# Altium schematic sheet OK6010_DB_DAC_f.SchDoc
size 260 x 195 mm; PageSetup: Record=PageOptions|CenterHorizontal=True|CenterVertical=True|PrintScale=1.02|XCorrection=1.00|YCorrection=1.00|PrintKind=2|BorderSize=5000000|LeftOffset=0|BottomOffset=0|Orientation=2|PaperLength=1000|PaperWidth=1000|Scale=100|PaperSource=15|PrintQuality=600|MediaType=1|DitherType=10|PaperKind=Letter|PrintScaleMode=1
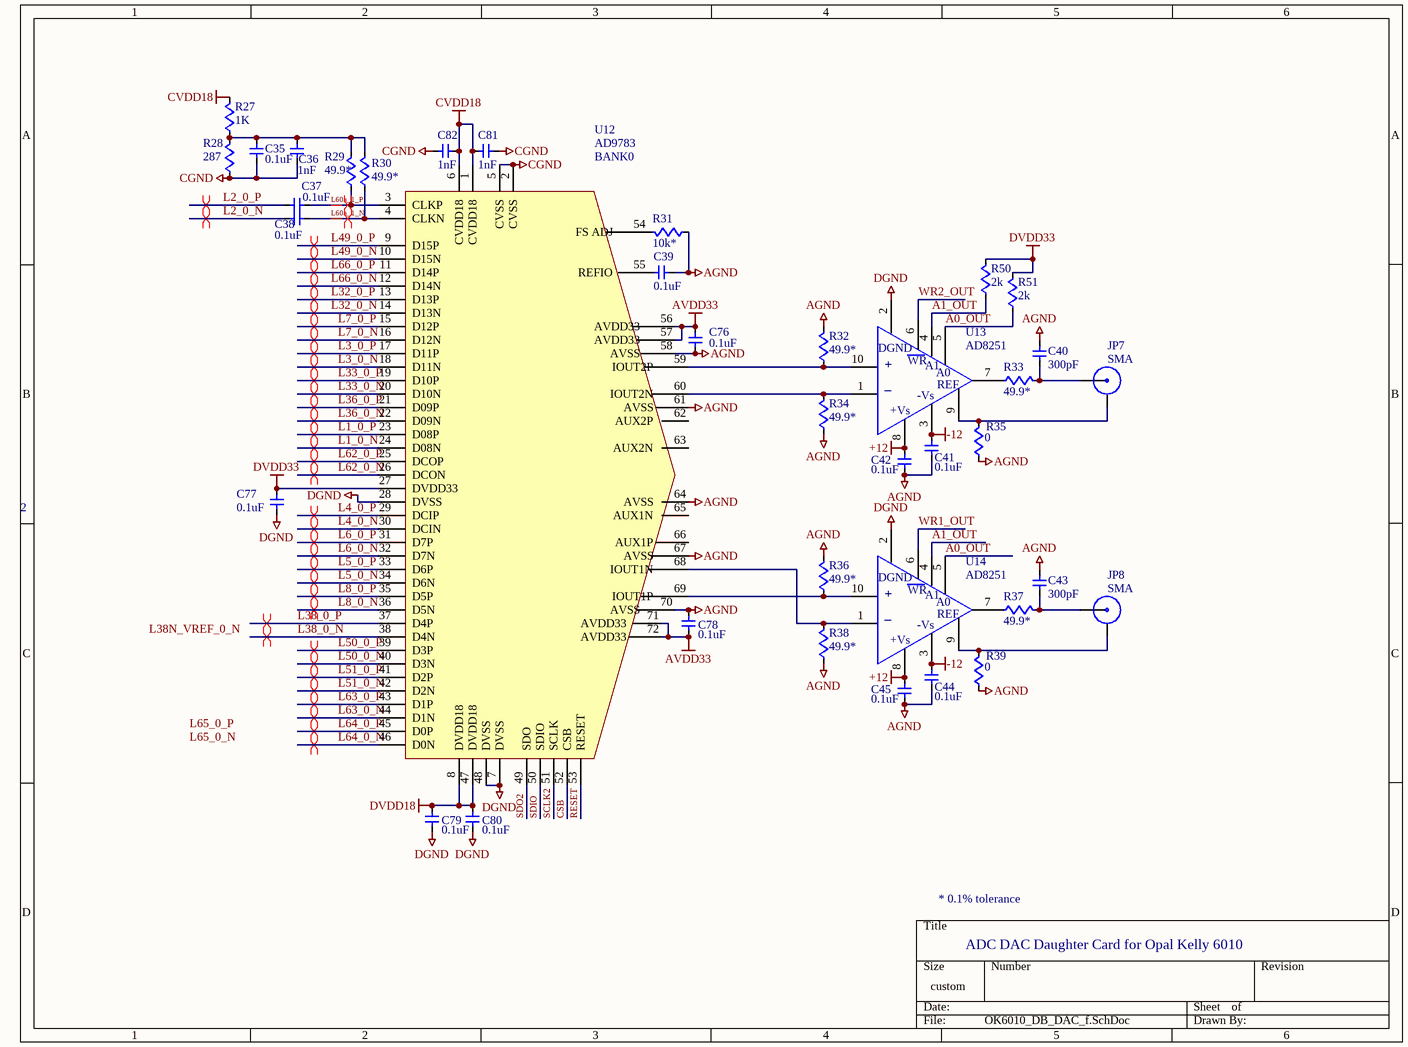
[diagram p0: OK6010_DB_DAC_f.SchDoc]

## Parts
C35  0.1uF  [0603w]
C36  1nF  [0603w]
C37  0.1uF  [1206]
C38  0.1uF  [1206]
C39  0.1uF  [0603w]
C40  300pF  [0603w]
C41  0.1uF  [0603w]
C42  0.1uF  [0603w]
C43  300pF  [0603w]
C44  0.1uF  [0603w]
C45  0.1uF  [0603w]
C76  0.1uF  [0603w]
C77  0.1uF  [0603w]
C78  0.1uF  [0603w]
C79  0.1uF  [0603w]
C80  0.1uF  [0603w]
C81  1nF  [0603w]
C82  1nF  [0603w]
JP7  SMA  [sma_pcb_200]
JP8  SMA  [sma_pcb_200]
R27  1K  [0603w]
R28  287  [0603w]
R29  49.9*  [0603w]
R30  49.9*  [0603w]
R31  10k*  [0603w]
R32  49.9*  [0603w]
R33  49.9*  [0603w]
R34  49.9*  [0603w]
R35  0  [0603w]
R36  49.9*  [0603w]
R37  49.9*  [0603w]
R38  49.9*  [0603w]
R39  0  [0603w]
R50  2k  [0603w]
R51  2k  [0603w]
U12  AD9783  [LFCSP72]
U13  AD8251  [MSOP10sm]
U14  AD8251  [MSOP10sm]

## Nets
+12: C42.2 C45.2 U13.8 U14.8
-12: C41.2 C44.2 U13.3 U14.3
AGND: C39.2 C40.2 C41.1 C42.1 C43.2 C44.1 C45.1 C76.1 C78.2 R31.1 R32.2 R34.1 R35.1 R36.2 R38.1 R39.1 U12.58(AVSS) U12.61(AVSS) U12.64(AVSS) U12.67(AVSS) U12.70(AVSS)
AVDD33: C76.2 C78.1 U12.56(AVDD33) U12.57(AVDD33) U12.71(AVDD33) U12.72(AVDD33)
CGND: C35.2 C36.2 C81.2 C82.2 R28.1 U12.2(CVSS) U12.5(CVSS)
CVDD18: C81.1 C82.1 R27.2 U12.1(CVDD18) U12.6(CVDD18)
DGND: C77.2 C79.1 C80.1 U12.7(DVSS) U12.28(DVSS) U12.48(DVSS) U13.2 U14.2
DVDD18: C79.2 C80.2 U12.8(DVDD18) U12.47(DVDD18)
DVDD33: C77.1 R50.2 R51.2 U12.27(DVDD33)
A0_OUT: R51.1 U13.5 U14.5
A1_OUT: R50.1 U13.4 U14.4
CSB: U12.52(CSB)
L1_0_N: U12.24(D08N)
L1_0_P: U12.23(D08P)
L2_0_N: C38.1
L2_0_P: C37.1
L3_0_N: U12.18(D11N)
L3_0_P: U12.17(D11P)
L4_0_N: U12.30(DCIN)
L4_0_P: U12.29(DCIP)
L5_0_N: U12.34(D6N)
L5_0_P: U12.33(D6P)
L6_0_N: U12.32(D7N)
L6_0_P: U12.31(D7P)
L7_0_N: U12.16(D12N)
L7_0_P: U12.15(D12P)
L8_0_N: U12.36(D5N)
L8_0_P: U12.35(D5P)
L32_0_N: U12.14(D13N)
L32_0_P: U12.13(D13P)
L33_0_N: U12.20(D10N)
L33_0_P: U12.19(D10P)
L36_0_N: U12.22(D09N)
L36_0_P: U12.21(D09P)
L38_0_N: U12.38(D4N)
L38_0_P: U12.37(D4P)
L49_0_N: U12.10(D15N)
L49_0_P: U12.9(D15P)
L50_0_N: U12.40(D3N)
L50_0_P: U12.39(D3P)
L51_0_N: U12.42(D2N)
L51_0_P: U12.41(D2P)
L60a_1_N: C38.2 R30.1 U12.4(CLKN)
L60a_1_P: C37.2 R29.1 U12.3(CLKP)
L62_0_N: U12.26(DCON)
L62_0_P: U12.25(DCOP)
L63_0_N: U12.44(D1N)
L63_0_P: U12.43(D1P)
L64_0_N: U12.46(D0N)
L64_0_P: U12.45(D0P)
L66_0_N: U12.12(D14N)
L66_0_P: U12.11(D14P)
RESET: U12.53(RESET)
SCLK2: U12.51(SCLK)
SDIO: U12.50(SDIO)
SDO2: U12.49(SDO)
WR1_OUT: U14.6
WR2_OUT: U13.6
NetC35_1: C35.1 C36.1 R27.1 R28.2 R29.2 R30.2
NetC39_1: C39.1 U12.55(REFIO)
NetC40_1: C40.1 JP7.1(signal) R33.2
NetC43_1: C43.1 JP8.1(signal) R37.2
NetJP7_0: JP7.0(ground) R35.2 U13.9
NetJP8_0: JP8.0(ground) R39.2 U14.9
NetR31_2: R31.2 U12.54(FS_ADJ)
NetR32_1: R32.1 U12.59(IOUT2P) U13.10
NetR33_1: R33.1 U13.7
NetR34_2: R34.2 U12.60(IOUT2N) U13.1
NetR36_1: R36.1 U12.69(IOUT1P) U14.10
NetR37_1: R37.1 U14.7
NetR38_2: R38.2 U12.68(IOUT1N) U14.1

Not connected (* = marked no-connect by the designer): U12 62(AUX2P) 63(AUX2N) 65(AUX1N) 66(AUX1P)

## Layout directives
differential pair: L1_0_N, L1_0_P, L2_0_N, L2_0_P, L3_0_N, L3_0_P, L4_0_N, L4_0_P, L5_0_N, L5_0_P, L6_0_N, L6_0_P, L7_0_N, L7_0_P, L8_0_N, L8_0_P, L32_0_N, L32_0_P, L33_0_N, L33_0_P, L36_0_N, L36_0_P, L38_0_N, L38_0_P, L49_0_N, L49_0_P, L50_0_N, L50_0_P, L51_0_N, L51_0_P, L60a_1_N, L60a_1_P, L62_0_N, L62_0_P, L63_0_N, L63_0_P, L64_0_N, L64_0_P, L66_0_N, L66_0_P

## Notes on the sheet
- (near U12) BANK0
- 2
- * 0.1% tolerance
- ADC DAC Daughter Card for Opal Kelly 6010
- Labels drawn without touching a wire or pin: L38N_VREF_0_N, L65_0_N, L65_0_P
- (in symbol AD8251) DGND; WR; +; A1; A0; _; REF; -Vs; +Vs

## Library data of the parts
C35 C39 C41 C42 C44 C45 C76-C80 = CAP_SM_1: capacitor; Manufacturer: Kemet; Manufacturer Part Number: C0603C104K3RACTU; Capacitance: 0.1µF; Temperature Coefficient: X7R; Tolerance: ±10%; Voltage - Rated: 25V; Applications: General Purpose; Category: Capacitors; ComponentLink1Description: http://www.kemet.com/datasheets&C0603C104K3RACTU; ComponentLink1URL: http://www.kemet.com/datasheets&C0603C104K3RACTU; Features: -; Lead Spacing: -; Lead Style: -; Mounting Type: Surface Mount, MLCC; Operating Temperature: -55°C ~ 125°C; Package / Case: 0603 (1608 Metric); Packaging: Cut Tape (CT); Pricing 1: 10=0.075, 100=0.027, 250=0.01952, 500=0.0144, 1000=0.00975 (USD); Ratings: -; RoHS: RoHS Compliant; Size / Dimension: 0.063" L x 0.032" W (1.60mm x 0.80mm); Stock 1: 2338960; Supplier 1: Digi-Key; Supplier Part Number 1: 399-1281-1-ND; Thickness: 0.80mm
C36 C81 C82 = CAP_SM_1: capacitor; Manufacturer: Murata Electronics North America; Manufacturer Part Number: GRM188R71H102KA01D; Description: CAP CER 1000PF 50V 10% X7R 0603; Capacitance: 1000pF; Voltage - Rated: 50V; Tolerance: ±10%; Temperature Coefficient: X7R; Supplier 1: Digi-Key; Supplier Part Number 1: 490-1494-1-ND; RoHS: RoHS Compliant; Category: Capacitors; Stock 1: 512721; Pricing 1: 1=0.07, 10=0.043, 50=0.0204, 100=0.0153, 250=0.01104, 500=0.00816, 1000=0.00553 (USD); Mounting Type: Surface Mount, MLCC; Operating Temperature: -55°C ~ 125°C; Applications: General Purpose; Ratings: -; Package / Case: 0603 (1608 Metric); Size / Dimension: 0.063" L x 0.031" W (1.60mm x 0.80mm); Height: -; Thickness: 0.035" (0.90mm); Lead Spacing: -; Features: -; Packaging: Cut Tape (CT); Lead Style: -; ComponentLink1URL: http://search.murata.co.jp/Ceramy/image/img/PDF/ENG/GRM188R71H102KA01.pdf; ComponentLink1Description: http://search.murata.co.jp/Ceramy/image/img/PDF/ENG/GRM188R71H102KA01.pdf
C37 C38 = CAP_SM_1: capacitor; Manufacturer: Murata Electronics North America; Manufacturer Part Number: GRM31C5C1E104JA01L; Description: CAP CER .1UF 25V 5% C0G 1206; Capacitance: 0.1µF; Voltage - Rated: 25V; Tolerance: ±5%; Temperature Coefficient: C0G, NP0; Supplier 1: Digi-Key; Supplier Part Number 1: 490-1767-1-ND; RoHS: RoHS Compliant; Category: Capacitors; Stock 1: 374793; Pricing 1: 1=0.57, 10=0.48, 50=0.3436, 100=0.3007, 250=0.23628, 500=0.2148, 1000=0.17184 (USD); Mounting Type: Surface Mount, MLCC; Operating Temperature: -55°C ~ 125°C; Applications: General Purpose; Ratings: -; Package / Case: 1206 (3216 Metric); Size / Dimension: 0.126" L x 0.063" W (3.20mm x 1.60mm); Height: -; Thickness: 0.071" (1.80mm); Lead Spacing: -; Features: -; Packaging: Cut Tape (CT); Lead Style: -; ComponentLink1URL: http://search.murata.co.jp/Ceramy/image/img/PDF/ENG/GRM31C5C1E104JA01.pdf; ComponentLink1Description: http://search.murata.co.jp/Ceramy/image/img/PDF/ENG/GRM31C5C1E104JA01.pdf
C40 C43 = CAP_SM_1: capacitor; Supplier 1: Digi-Key; Supplier Part Number 1: 490-1438-1-ND
JP7 = SMA_EDGE: sma connector; Manufacturer: TE Connectivity; Manufacturer Part Number: 5-1814832-1; Description: CONN SOCKET SMA STR DIE CAST PCB; Connector Type: Jack, Female Sockets; Contact Termination: Solder; Impedance: 50 Ohm; Frequency - Max: 3GHz; Supplier 1: Digi-Key; Supplier Part Number 1: A97594-ND; RoHS: RoHS Compliant; Category: Connectors, Interconnects; Stock 1: 22563; Pricing 1: 1=2.7, 25=2.322, 50=2.052, 100=1.836, 250=1.62, 500=1.4364 (USD); Connector Style: SMA; Mounting Type: Through Hole; Fastening Type: Threaded; Cable Group: -; Features: -; Color: -; Packaging: Bulk; ComponentLink1URL: http://documents.tycoelectronics.com/commerce/DocumentDelivery/DDEController?Action=srchrtrv&DocNm=1814832&DocType=CD&DocLang=EN; ComponentLink1Description: http://documents.tycoelectronics.com/commerce/DocumentDelivery/DDEController?Action=srchrtrv&DocNm=1814832&DocType=CD&DocLang=EN
JP8 = SMA_EDGE: sma connector; Manufacturer: TE Connectivity; Manufacturer Part Number: 5-1814832-1; Connector Type: Jack, Female Sockets; Contact Termination: Solder; Frequency - Max: 3GHz; Impedance: 50 Ohm; Cable Group: -; Category: Connectors, Interconnects; Color: -; ComponentLink1Description: http://documents.tycoelectronics.com/commerce/DocumentDelivery/DDEController?Action=srchrtrv&DocNm=1814832&DocType=CD&DocLang=EN; ComponentLink1URL: http://documents.tycoelectronics.com/commerce/DocumentDelivery/DDEController?Action=srchrtrv&DocNm=1814832&DocType=CD&DocLang=EN; Connector Style: SMA; Fastening Type: Threaded; Features: -; Mounting Type: Through Hole; Packaging: Bulk; Pricing 1: 1=2.7, 25=2.322, 50=2.052, 100=1.836, 250=1.62, 500=1.4364 (USD); RoHS: RoHS Compliant; Stock 1: 22563; Supplier 1: Digi-Key; Supplier Part Number 1: A97594-ND
R27 = RES_SM: resistor; Manufacturer: Yageo; Manufacturer Part Number: RC0603FR-071KL; Description: RES 1.00K OHM 1/10W 1% 0603 SMD; Power (Watts): 0.1W, 1/10W; Temperature Coefficient: ±100ppm/°C; Tolerance: ±1%; Supplier 1: Digi-Key; Supplier Part Number 1: 311-1.00KHRCT-ND; RoHS: RoHS Compliant; Category: Resistors; Stock 1: 4416298; Pricing 1: 10=0.014, 50=0.0104, 100=0.0079, 250=0.00584, 500=0.00432, 1000=0.00288 (USD); Resistance (Ohms): 1K; Composition: Thick Film; Features: -; Size / Dimension: 0.063" L x 0.031" W (1.60mm x 0.80mm); Height: 0.018" (0.45mm); Number of Terminations: 2; Packaging: Cut Tape (CT); Package / Case: 0603 (1608 Metric); ComponentLink1URL: http://www.yageo.com/documents/recent/PYu-RC0603_51_RoHS_L_4.pdf; ComponentLink1Description: http://www.yageo.com/documents/recent/PYu-RC0603_51_RoHS_L_4.pdf
R28 = RES_SM: resistor; Manufacturer: Yageo; Manufacturer Part Number: RC0603FR-07287RL; Description: RES 287 OHM 1/10W 1% 0603 SMD; Power (Watts): 0.1W, 1/10W; Temperature Coefficient: ±100ppm/°C; Tolerance: ±1%; Supplier 1: Digi-Key; Supplier Part Number 1: 311-287HRCT-ND; RoHS: RoHS Compliant; Category: Resistors; Stock 1: 82528; Pricing 1: 10=0.014, 50=0.0104, 100=0.0079, 250=0.00584, 500=0.00432, 1000=0.00288 (USD); Resistance (Ohms): 287; Composition: Thick Film; Features: -; Size / Dimension: 0.063" L x 0.031" W (1.60mm x 0.80mm); Height: 0.018" (0.45mm); Number of Terminations: 2; Packaging: Cut Tape (CT); Package / Case: 0603 (1608 Metric); ComponentLink1URL: http://www.yageo.com/documents/recent/PYu-RC0603_51_RoHS_L_4.pdf; ComponentLink1Description: http://www.yageo.com/documents/recent/PYu-RC0603_51_RoHS_L_4.pdf
R29 R30 R32-R34 R36-R38 = RES_SM: resistor; Manufacturer: Stackpole Electronics Inc; Manufacturer Part Number: RNCS0603BKE49R9; Description: RES 1/16W 49.9 OHM 0.1% 0603; Resistance (Ohms): 49.9; Power (Watts): 0.063W, 1/16W; Temperature Coefficient: ±25ppm/°C; Tolerance: ±0.1%; Supplier 1: Digi-Key; Supplier Part Number 1: RNCS0603BKE49R9CT-ND; RoHS: RoHS Compliant; Category: Resistors; Stock 1: 13782; Pricing 1: 1=0.7, 10=0.475, 50=0.2876, 100=0.2375, 250=0.18752, 500=0.16 (USD); Composition: Thin Film; Features: Anti-Corrosive, Moisture Resistant; Size / Dimension: 0.061" L x 0.031" W (1.55mm x 0.80mm); Height: 0.018" (0.45mm); Number of Terminations: 2; Packaging: Cut Tape (CT); Package / Case: 0603 (1608 Metric); ComponentLink1URL: http://www.seielect.com/Catalog/SEI-rncs.pdf; ComponentLink1Description: http://www.seielect.com/Catalog/SEI-rncs.pdf
R31 = RES_SM: resistor; Manufacturer: Susumu; Manufacturer Part Number: RG1608P-103-B-T5; Description: RES 10.0K OHM 1/10W .1% 0603 SMD; Resistance (Ohms): 10K; Power (Watts): 0.1W, 1/10W; Temperature Coefficient: ±25ppm/°C; Tolerance: ±0.1%; Supplier 1: Digi-Key; Supplier Part Number 1: RG16P10.0KBCT-ND; RoHS: RoHS Compliant; Category: Resistors; Stock 1: 368390; Pricing 1: 10=0.409, 50=0.2478, 200=0.2047, 1000=0.10342 (USD); Composition: Thin Film; Features: -; Size / Dimension: 0.063" L x 0.031" W (1.60mm x 0.80mm); Height: 0.016" (0.40mm); Number of Terminations: 2; Packaging: Cut Tape (CT); Package / Case: 0603 (1608 Metric); ComponentLink1URL: http://www.susumu-usa.com/pdf/RG_RM_RGH_DATASHEET.pdf; ComponentLink1Description: http://www.susumu-usa.com/pdf/RG_RM_RGH_DATASHEET.pdf
R35 R39 = RES_SM: resistor; Supplier 1: Digi-Key; Supplier Part Number 1: P0.0GCT-ND
R50 R51 = RES_SM: resistor; Manufacturer: Yageo; Manufacturer Part Number: RC0603FR-072KL; Power (Watts): 0.1W, 1/10W; Temperature Coefficient: ±100ppm/°C; Tolerance: ±1%; Description: RES 2.00K OHM 1/10W 1% 0603 SMD; Category: Resistors; ComponentLink1Description: http://www.yageo.com/documents/recent/PYu-RC0603_51_RoHS_L_4.pdf; ComponentLink1URL: http://www.yageo.com/documents/recent/PYu-RC0603_51_RoHS_L_4.pdf; Composition: Thick Film; Features: -; Height: 0.018" (0.45mm); Number of Terminations: 2; Package / Case: 0603 (1608 Metric); Packaging: Cut Tape (CT); Pricing 1: 10=0.014, 50=0.0104, 100=0.0079, 250=0.00584, 500=0.00432, 1000=0.00288 (USD); Resistance (Ohms): 2K; RoHS: RoHS Compliant; Size / Dimension: 0.063" L x 0.031" W (1.60mm x 0.80mm); Stock 1: 1129886; Supplier 1: Digi-Key; Supplier Part Number 1: 311-2.00KHRCT-ND
U12 = AD9783: DAC LVDS DUAL16BIT 500MSPS; Supplier 1: Digi-Key; Supplier Part Number 1: AD9783BCPZ-ND
U13 U14 = AD8251: IC AMP INST ICMOS LDRIFT 10MSOP; Supplier 1: Digi-Key; Supplier Part Number 1: AD8251ARMZ-ND